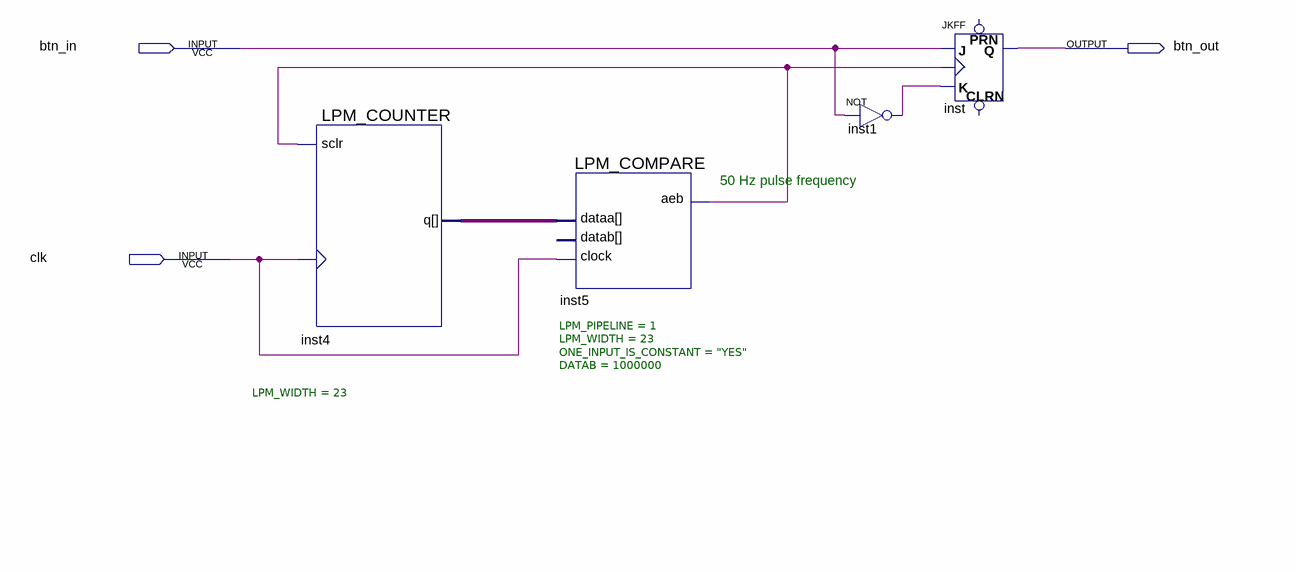
[diagram p0: schematic sheet]
// Quartus schematic debouncer.bdf as structural Verilog: 4 symbols, 3 pins
module debouncer (
  input  btn_in,
  input  clk,
  output btn_out
);

  wire inst1_out, inst5_aeb;
  wire [22:0] inst4_q;

  LPM_COUNTER #(.LPM_WIDTH(23)) inst4 (.clock(clk), .sclr(inst5_aeb), .q(inst4_q));
  LPM_COMPARE #(.LPM_PIPELINE(1), .LPM_WIDTH(23), .ONE_INPUT_IS_CONSTANT("YES"), .DATAB(1000000)) inst5 (
    .clock(clk), .dataa(inst4_q), .aeb(inst5_aeb));  // open: datab
  not inst1 (inst1_out, btn_in);
  JKFF inst (.K(inst1_out), .J(btn_in), .CLK(inst5_aeb), .Q(btn_out));  // open: PRN, CLRN

  // Notes on the sheet:
  //   50 Hz pulse frequency
endmodule
